# EAGLE design 313_lora_CMWX1ZZABZ (EAGLE 9.6.2)
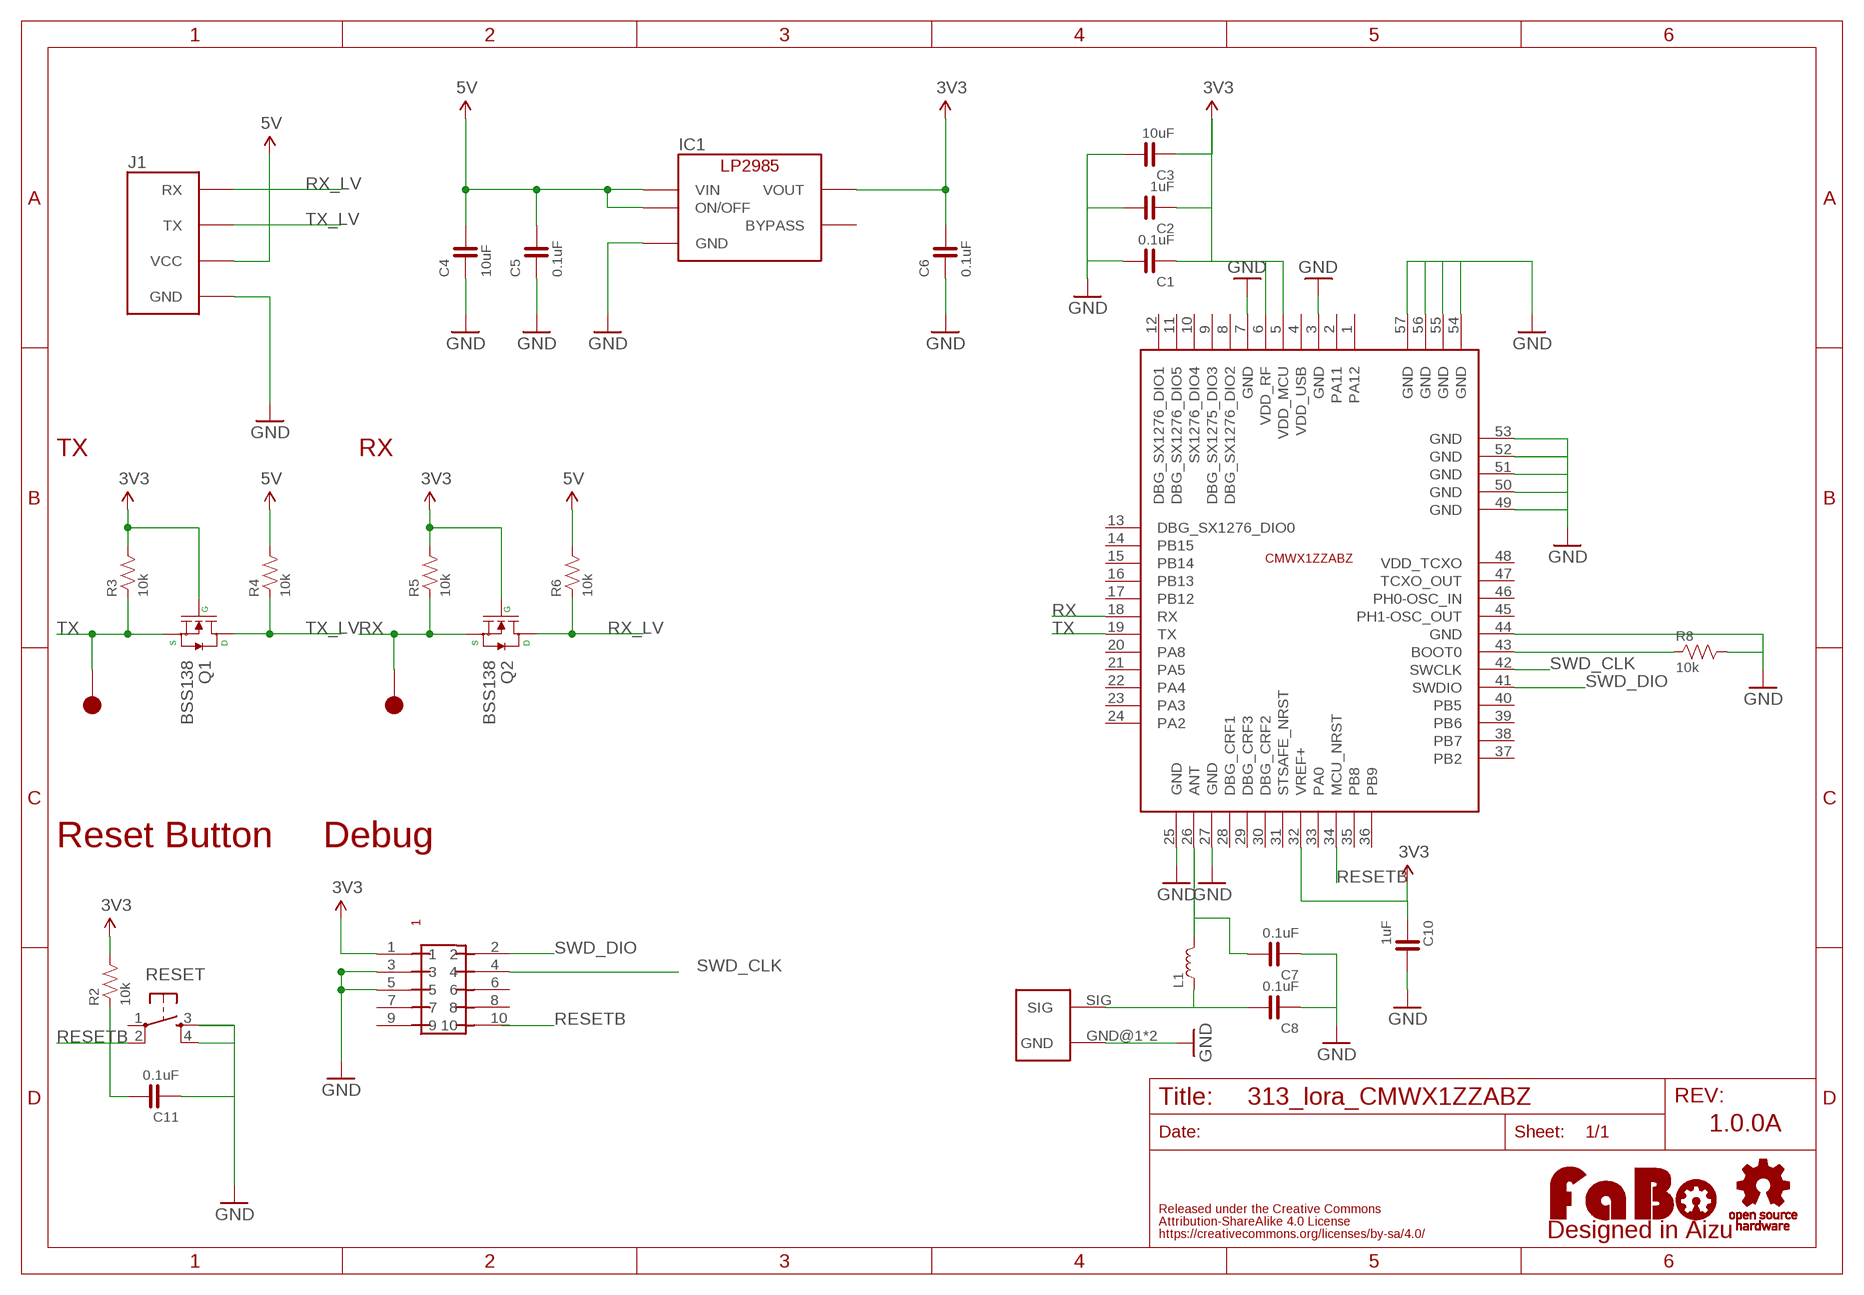
[diagram p0: schematic, sheet 1]

## Parts
C1  0.1uF  CAPACITOR-0603_NARROW  [0603-NARROW]
C2  1uF  CAPACITOR-0603_NARROW  [0603-NARROW]
C3  10uF  CAPACITOR-0603_NARROW  [0603-NARROW]
C4  10uF  CAPACITOR-0603_NARROW  [0603-NARROW]
C5  0.1uF  CAPACITOR-0603_NARROW  [0603-NARROW]
C6  0.1uF  CAPACITOR-0603_NARROW  [0603-NARROW]
C7  0.1uF  CAPACITOR-0603_NARROW  [0603-NARROW]
C8  0.1uF  CAPACITOR-0603_NARROW  [0603-NARROW]
C10  1uF  CAPACITOR-0603_NARROW  [0603-NARROW]
C11  0.1uF  CAPACITOR-0603_NARROW  [0603-NARROW]
IC1  LP2985-33DBV  [SOT-23-5]
J1  FABO_BRICK_SERIAL-LONGER  [FABO_BRICK_SERIAL_LONGER]
L1  COIL-0603  [0603]
LOGO1  LOGO_FABO-M_BOTTOM  [LOGO_FABO_M_BOTTOM]
Q1  BSS138  MOSFET-N  [SOT23-3]
Q2  BSS138  MOSFET-N  [SOT23-3]
R2  10k  RESISTOR-0603-NARROW  [0603-NARROW]
R3  10k  RESISTOR-0603-NARROW  [0603-NARROW]
R4  10k  RESISTOR-0603-NARROW  [0603-NARROW]
R5  10k  RESISTOR-0603-NARROW  [0603-NARROW]
R6  10k  RESISTOR-0603-NARROW  [0603-NARROW]
R8  10k  RESISTOR-0603-NARROW  [0603-NARROW]
RESET  TACT-SWITCH-SMD_KMR2  [KMR2]
TP10  TP-15  [TP-15]
TP11  TP-15  [TP-15]
U$2  LOGO_OSHW-M_BOTTOM  [LOGO_OSHW_M_BOTTOM]
U$3  CMWX1ZZABZ  [CMWX1ZZABZ]
U$8  PIN-HEADER-SMT(1.27MM)2X5  [PIN-HEADER-SMT(1.27MM)2X5]
UF1  HIROSE-U.FL  [HIROSE-UF.L]

## Nets
3V3: C1.1 C2.1 C3.1 C6.2 C10.1 IC1.5(VOUT) Q1.1(G) Q2.1(G) R2.2 R3.2 R5.2 U$3.5(VDD_MCU) U$3.6(VDD_RF) U$3.32(VREF+) U$8.1
5V: C4.2 C5.2 IC1.1(VIN) IC1.3(ON/OFF) J1.VCC R4.2 R6.2
GND: C1.2 C2.2 C3.2 C4.1 C5.1 C6.1 C7.1 C8.1 C10.2 C11.1 IC1.2(GND) J1.GND R8.2 RESET.3 RESET.4 U$3.3(GND) U$3.7(GND) U$3.25(GND) U$3.27(GND) U$3.44(GND) U$3.49(GND) U$3.50(GND) U$3.51(GND) U$3.52(GND) U$3.53(GND) U$3.54(GND) U$3.55(GND) U$3.56(GND) U$3.57(GND) U$8.3 U$8.5 UF1.GND@1(GND) UF1.GND@2(GND)
N$2: C7.2 L1.2 U$3.26(ANT)
N$3: C8.2 L1.1 UF1.SIG
N$4: R8.1 U$3.43(BOOT0)
RESETB: C11.2 R2.1 RESET.2 U$3.34(MCU_NRST) U$8.10
RX: Q2.2(S) R5.1 TP10.1 U$3.18(RX)
RX_LV: J1.RX Q2.3(D) R6.1
SWD_CLK: U$3.42(SWCLK) U$8.4
SWD_DIO: U$3.41(SWDIO) U$8.2
TX: Q1.2(S) R3.1 TP11.1 U$3.19(TX)
TX_LV: J1.TX Q1.3(D) R4.1
Unconnected: IC1.4(BYPASS) RESET.1 U$3.1(PA12) U$3.2(PA11) U$3.4(VDD_USB) U$3.8(DBG_SX1276_DIO2) U$3.9(DBG_SX1275_DIO3) U$3.10(SX1276_DIO4) U$3.11(DBG_SX1276_DIO5) U$3.12(DBG_SX1276_DIO1) U$3.13(DBG_SX1276_DIO0) U$3.14(PB15) U$3.15(PB14) U$3.16(PB13) U$3.17(PB12) U$3.20(PA8) U$3.21(PA5) U$3.22(PA4) U$3.23(PA3) U$3.24(PA2) U$3.28(DBG_CRF1) U$3.29(DBG_CRF3) U$3.30(DBG_CRF2) U$3.31(STSAFE_NRST) U$3.33(PA0) U$3.35(PB8) U$3.36(PB9) U$3.37(PB2) U$3.38(PB7) U$3.39(PB6) U$3.40(PB5) U$3.45(PH1-OSC_OUT) U$3.46(PH0-OSC_IN) U$3.47(TCXO_OUT) U$3.48(VDD_TCXO) U$8.6 U$8.7 U$8.8 U$8.9

## Notes on the sheet
- TX | RX
- Reset Button | Debug
- 1.0.0A

## Library data of the parts
C1-C8 C10 C11 = FaBo-Capacitor:CAPACITOR: CAPACITOR
IC1 = FaBo-Supply:LP2985: LP2985
J1 = FaBo-Template:FABO_BRICK_SERIAL: FaBo Brick Serial
L1 = FaBo-Coil:COIL: RESISTOR
LOGO1 = component:LOGO_FABO
Q1 Q2 = FaBo-etc:MOSFET-N
R2-R6 R8 = FaBo-Resistors:RESISTOR: RESISTOR
RESET = FaBo-Switch:TACT-SWITCH
TP10 TP11 = FaBo-Supply:TP
U$2 = component:LOGO_OSHW
U$3 = FaBo-LoRa:CMWX1ZZABZ
U$8 = GClue:PIN-HEADER-SMT(1.27MM)2X5: PIN-HEADER-SMT (1.27MM) 2x5
UF1 = FaBo-Connetor:HIROSE-U.FL

## Board
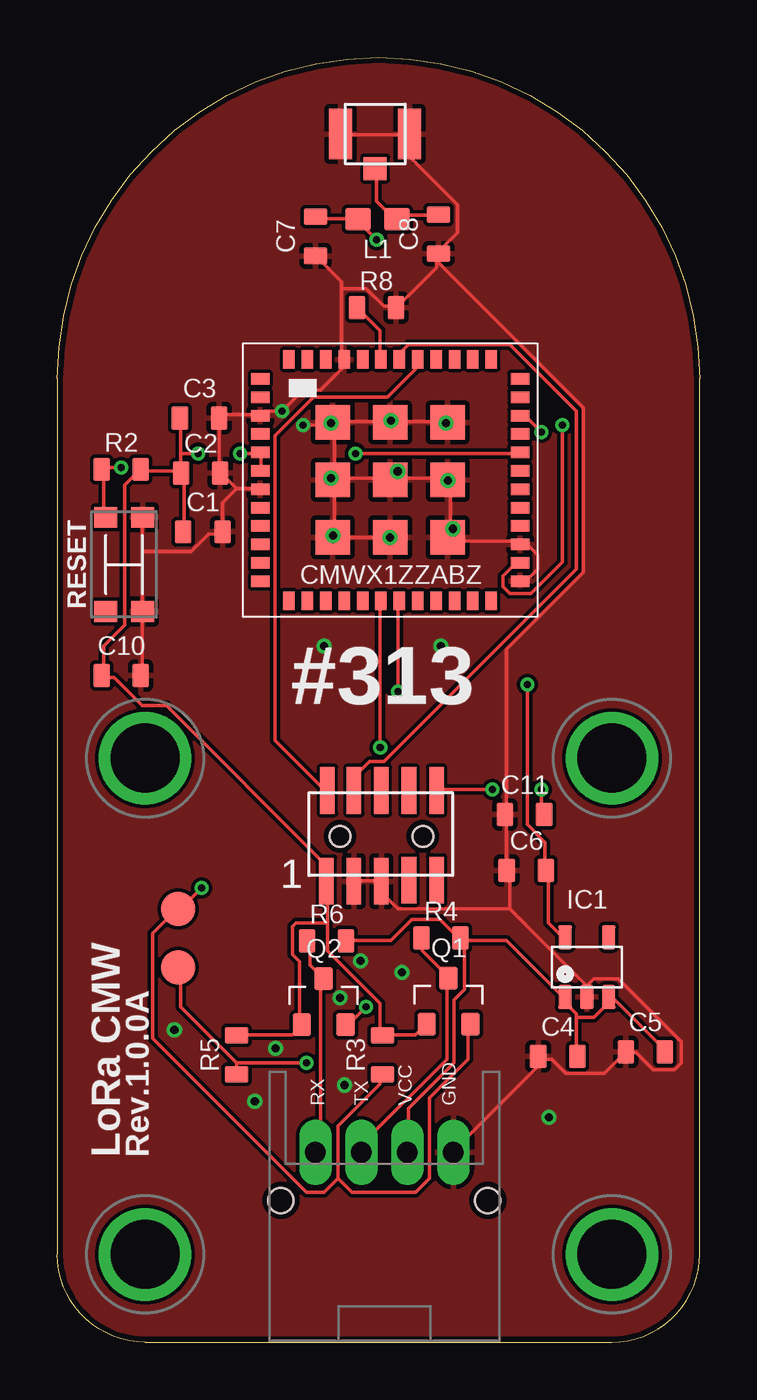
[diagram p1: board, top side]
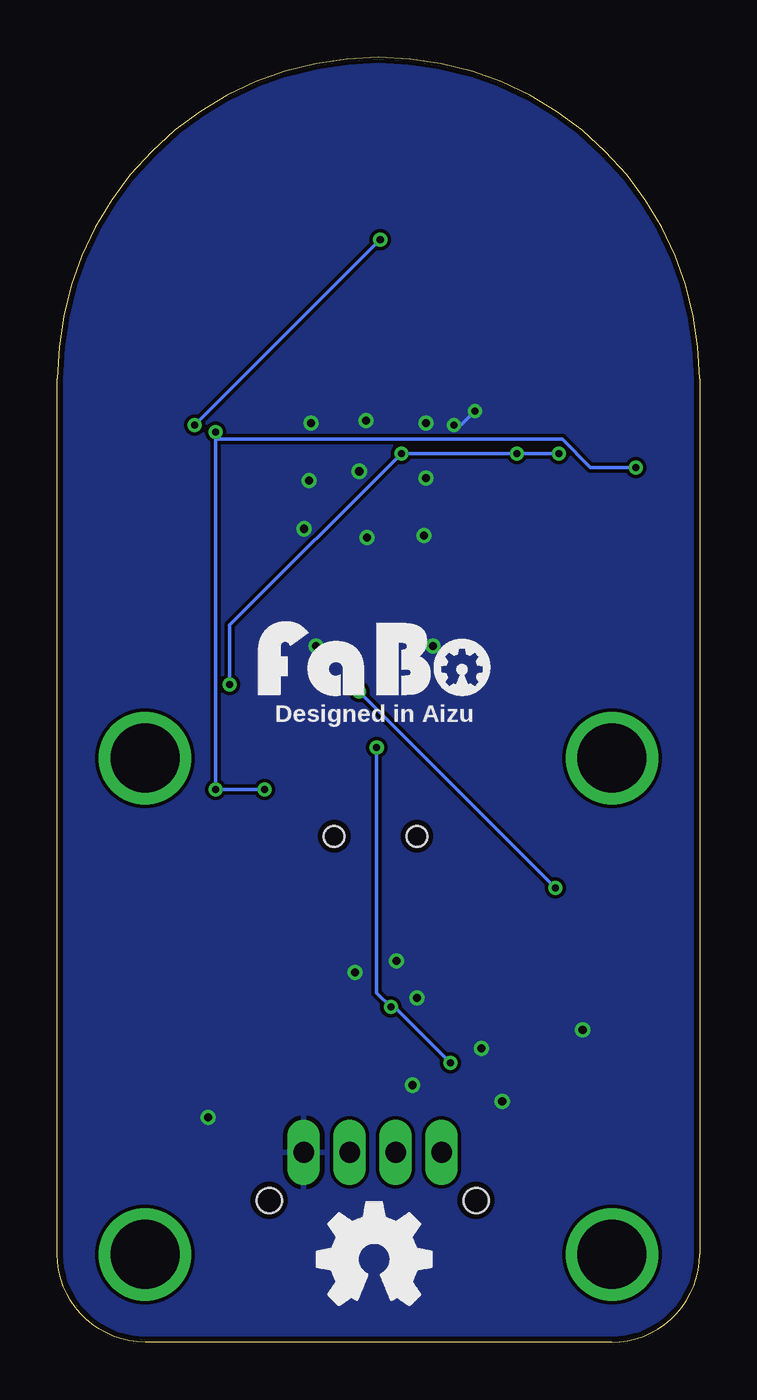
[diagram p2: board, bottom side, seen from below]

Size 27.94 x 55.88 mm. Coordinates in mm from the lower left corner, seen from the top.
Copper layers (1*16): Top 0.035mm / dielectric 1.6mm / Bottom 0.035mm
Design rules "PCBway": minimum track width 6mil, minimum drill 12mil, track to track 6mil, track to pad 6mil, pad to pad 6mil, via to via 6mil, smd to smd 6mil, copper to edge 10mil, drill to drill 10mil, minimum pad ring 10mil, minimum via ring 6mil, stop-mask expansion 2mil, vias tented up to drill 100mil, thermal gap 8mil

### Footprints (pad centres in the part's own frame; a part is rotated, then mirrored left to right if it is on the bottom)
0603-NARROW = smd 0.71 x 1: 1 -0.85,0; 2 0.85,0
SOT-23-5 = smd 0.6 x 1.05: 1 -0.95,-1.3; 2 0,-1.3; 3 0.95,-1.3; 4 0.95,1.3; 5 -0.95,1.3
FABO_BRICK_SERIAL_LONGER = drill 0.9 pad 1.422 long: GND 3.254,-17.145; RX -2.746,-17.145; TX -0.746,-17.145; VCC 1.254,-17.145 | drill 3 pad 3.81: P$5 -10.16,0; P$6 10.16,0; P$7 -10.16,-21.59; P$8 10.16,-21.59 | hole 1.1: -4.246,-19.245; 4.754,-19.245
0603 = smd 1.1 x 1: 1 -0.85,0; 2 0.85,0
SOT23-3 = smd 0.8 x 1: 1 -0.95,-1; 2 0.95,-1; 3 0,1
KMR2 = smd 0.9 x 1: 1 -2.05,0.8; 2 2.05,0.8; 3 2.05,-0.8; 4 -2.05,-0.8
TP-15 = smd 1.5 x 1.5: 1 0,0
CMWX1ZZABZ = smd 0.8 x 0.5: 1 -5.65,4.4; 2 -5.65,3.6; 3 -5.65,2.8; 4 -5.65,2; 5 -5.65,1.2; 6 -5.65,0.4; 7 -5.65,-0.4; 8 -5.65,-1.2; 9 -5.65,-2; 10 -5.65,-2.8; 11 -5.65,-3.6; 12 -5.65,-4.4; 25 5.65,-4.4; 26 5.65,-3.6; 27 5.65,-2.8; 28 5.65,-2; 29 5.65,-1.2; 30 5.65,-0.4; 31 5.65,0.4; 32 5.65,1.2; 33 5.65,2; 34 5.65,2.8; 35 5.65,3.6; 36 5.65,4.4 | smd 0.5 x 0.8: 13 -4.4,-5.25; 14 -3.6,-5.25; 15 -2.8,-5.25; 16 -2,-5.25; 17 -1.2,-5.25; 18 -0.4,-5.25; 19 0.4,-5.25; 20 1.2,-5.25; 21 2,-5.25; 22 2.8,-5.25; 23 3.6,-5.25; 24 4.4,-5.25; 37 4.4,5.25; 38 3.6,5.25; 39 2.8,5.25; 40 2,5.25; 41 1.2,5.25; 42 0.4,5.25; 43 -0.4,5.25; 44 -2,5.25; 45 -1.2,5.25; 46 -2.8,5.25; 47 -3.6,5.25; 48 -4.4,5.25 | smd 1.5 x 1.5: 49 -2.5,2.5; 50 0,2.5; 51 2.5,2.5; 52 -2.5,0; 53 0,0; 54 2.5,0; 55 -2.5,-2.5; 56 0,-2.5; 57 2.5,-2.5
PIN-HEADER-SMT(1.27MM)2X5 = smd 0.635 x 2.032: 1 -2.4,-1.95; 2 -2.35,2; 3 -1.2,-1.95; 4 -1.2,2; 5 0,-1.95; 6 0,2; 7 1.2,-1.9; 8 1.2,2; 9 2.4,-1.9; 10 2.4,2 | hole 0.9: 1.8,0; -1.8,0
HIROSE-UF.L = smd 1 x 2.2: GND@1 -1.5,0; GND@2 1.5,0 | smd 1 x 1: SIG 0,-1.5

### Placement (x,y rotation side)
C1  6.33,35.25 0 top
C2  6.23,37.8 0 top
C3  6.18,40.2 0 top
C4  21.77,12.43 0 top
C5  25.58,12.63 0 top
C6  20.4,20.52 0 top
C7  11.23,48.1 90 top
C8  16.58,48.2 90 top
C10  2.78,29 0 top
C11  20.33,22.95 0 top
IC1  23.04,16.31 0 top
J1  13.97,25.4 0 top
L1  13.93,48.85 180 top
LOGO1  14.15,27.74 0 top
Q1  17.02,14.83 0 top
Q2  11.58,14.81 0 top
R2  2.77,37.96 0 top
R3  14.15,12.5 90 top
R4  16.69,17.58 0 top
R5  7.8,12.5 90 top
R6  11.71,17.45 0 top
R8  13.88,45 0 top
RESET  2.9,33.83 90 top
TP10  5.26,16.31 0 top
TP11  5.26,18.85 0 top
U$2  14.15,3.61 0 top
U$3  14.48,37.5 0 top
U$8  14.1,22 0 top
UF1  13.83,52.55 0 top

### Tracks (layer width: path | path; a pad name or v marks a point on that pad's centre or on a via)
3V3  (via drill 0.3)
  Top 0.152: IC1.5 21.97,17.63 21.36,18.24 21.36,20.37 C6.2 21.21,20.52 21.21,21.74 20.45,22.5 v20.45,28.6 | U$3.6 8.86,37.9 8.86,38.66 U$3.5 8.71,38.66 v7.95,38.66 | v12.98,38.66 19.99,38.66 U$3.32 | 5.36,37.9 3.68,37.9 R2.2 3.53,37.9 2.92,37.29 2.92,31.19 2.01,30.28 2.01,29.06 C10.1 2.01,28.9 2.46,28.9 3.68,27.69 4.75,27.69 11.61,20.83 11.61,20.07 U$8.1 11.76,19.91 11.76,18.24 | 5.36,37.9 5.36,38.66 | 5.36,38.66 5.36,40.18 C3.1 | 5.36,37.9 C2.1 5.51,37.74 5.51,35.31 C1.1 | R5.2 7.8,13.36 10.24,13.36 10.54,13.66 Q2.1 10.54,13.82 10.54,16.56 10.24,16.87 10.24,18.08 10.39,18.24 11.76,18.24 | Q1.1 16.03,13.82 15.57,13.36 14.2,13.36 R3.2 14.05,13.36 14.05,14.73 11.76,17.02 11.76,18.24 | 5.36,38.66 v6.12,38.66
  Bottom 0.152: v20.45,28.6 20.45,31.19 v12.98,38.66 v7.95,38.66 v6.12,38.66
5V
  Top 0.152: R6.2 12.67,17.47 14.5,17.47 15.42,18.39 16.64,18.39 17.4,17.63 R4.2 | 22.58,14.12 22.58,14.27 21.97,14.88 IC1.1 21.97,15.04 19.53,17.47 17.7,17.47 | 22.58,14.12 22.58,12.45 C4.2 | C5.2 26.39,12.75 24.1,15.04 IC1.3 24.1,14.88 23.34,14.12 22.58,14.12 | 17.7,17.47 17.55,17.47 R4.2 | 17.7,17.47 17.7,15.34 17.25,14.88 17.25,12.14 15.27,10.16 15.27,8.33 J1.VCC | 17.7,17.47 R4.2
GND  (via drill 0.3, 0.35)
  Top 0.152: J1.GND 17.25,8.33 20.9,11.99 20.9,12.29 C4.1 21.06,12.29 21.51,12.29 22.12,11.68 23.8,11.68 24.71,12.6 C5.1 24.87,12.6 25.17,12.6 25.93,11.84 26.85,11.84 27.15,12.14 27.15,13.06 24.41,15.8 23.34,15.8 23.04,15.49 | U$8.3 12.98,20.07 14.05,20.07 U$8.5 14.2,19.91 14.2,19.46 14.81,18.85 19.68,18.85 | 23.04,15.49 IC1.2 23.04,15.04 | 19.68,18.85 23.04,15.49 | 19.68,18.85 19.68,20.37 C6.1 19.53,20.52 19.53,22.81 C11.1 19.53,22.96 19.53,30.12 22.89,33.48 22.89,40.64 16.48,47.04 | UF1.GND@1 12.37,52.53 15.27,52.53 UF1.GND@2 15.42,52.53 15.42,51.46 17.4,49.48 17.4,48.26 16.64,47.5 C8.1 | 12.37,45.82 12.37,46.13 11.3,47.19 C7.1 | 12.37,45.82 12.37,42.77 U$3.44 12.37,42.62 12.37,42.32 11.46,41.4 10.69,41.4 v9.78,40.49 9.02,40.49 8.86,40.33 U$3.3 8.71,40.33 7.04,40.33 C3.2 7.04,40.18 7.04,37.9 C2.2 7.19,37.74 7.8,37.13 | 12.37,45.82 13.44,45.82 14.2,45.06 14.66,45.06 R8.2 14.81,45.06 16.48,46.74 16.48,47.04 | 16.48,47.04 16.48,47.35 C8.1 | U$3.25 20.14,33.17 20.45,33.17 20.9,33.63 20.9,34.24 20.45,34.7 20.14,34.7 U$3.27 19.99,34.85 17.09,34.85 U$3.57 17.09,35 17.09,37.44 U$3.54 16.94,37.59 14.5,37.59 U$3.53 14.35,37.59 12.06,37.59 | 12.06,35 14.35,35 U$3.56 | 12.06,37.59 12.06,39.88 U$3.49 | 12.06,37.59 U$3.52 12.06,37.44 12.06,35 | U$3.49 12.06,40.03 14.35,40.03 U$3.50 14.5,40.03 16.94,40.03 U$3.51 | 12.06,35 U$3.55 | 7.8,37.13 8.71,37.13 U$3.7 | 7.8,37.13 7.19,36.52 7.19,35.31 C1.2 7.04,35.15 6.58,35.15 5.82,34.39 3.68,34.39 | C10.2 3.68,29.06 3.68,31.65 RESET.4 3.68,31.8 3.68,34.39 | 3.68,34.39 3.68,35.76 RESET.3 | v10.69,39.88 11.91,39.88 U$3.49
  Top 0.152: 16.48,47.04 C8.1
  Bottom 0.152: v10.69,39.88 10.39,39.88 v9.78,40.49
  other vias: 11.61,30.28 16.69,30.28 14.48,35 16.99,37.48 14.99,16.08 5.09,13.58 12.49,11.18 8.59,10.48 9.49,12.78 13.19,16.58 12.29,14.98 21.39,9.78 11.99,35.08 11.91,39.98 14.51,40.08 16.91,39.98 11.91,37.58 17.21,35.38 14.81,37.88
  pour Bottom: 0.18,-0.2 0.18,56.31 28.12,56.31 28.12,-0.2
  pour Top: 0.18,-0.2 0.18,56.31 28.12,56.31 28.12,-0.2
N$2  (via drill 0.3)
  Top 0.152: v21.97,39.88 21.97,33.93 20.6,32.56 19.68,32.56 19.38,32.87 19.38,33.32 19.84,33.78 19.99,33.78 U$3.26 | v13.89,47.95 13.13,48.72 L1.2 12.98,48.87 11.3,48.87 C7.2
  Bottom 0.152: v13.89,47.95 v21.97,39.88
N$3
  Top 0.152: C8.2 16.48,49.02 14.96,49.02 14.81,48.87 L1.1 14.66,48.87 13.89,49.63 13.89,51 UF1.SIG
N$4
  Top 0.152: U$3.43 14.05,42.77 14.05,43.99 13.13,44.91 R8.1
RESETB  (via drill 0.3)
  Top 0.152: RESET.2 2.01,35.92 2.01,37.9 R2.1 2.01,38.05 v2.77,38.05 | v21.06,39.57 20.45,40.18 20.14,40.18 U$3.34 | v21.06,24.03 21.06,22.96 C11.2 | v18.92,24.03 16.64,24.03 U$8.10
  Bottom 0.152: 21.06,39.27 v21.06,24.03 v18.92,24.03 | 21.06,39.27 v21.06,39.57 | v2.77,38.05 4.75,38.05 5.97,39.27 21.06,39.27
RX  (via drill 0.3)
  Top 0.152: 7.8,12.14 R5.1 | 7.8,12.14 5.36,14.58 5.36,16.26 TP10.1 | v14.05,25.86 14.05,32.11 U$3.18 | v13.44,14.58 12.67,13.82 Q2.2 | v10.85,12.14 7.8,12.14
  Bottom 0.152: v14.05,25.86 14.05,15.19 v13.44,14.58 13.28,14.58 v10.85,12.14
RX_LV
  Top 0.152: R6.1 11,17.32 11,16.41 11.46,15.95 Q2.3 11.46,15.8 11.46,8.48 11.3,8.33 J1.RX
SWD_CLK
  Top 0.152: U$3.42 14.96,42.77 14.96,43.08 15.27,43.38 19.68,43.38 22.58,40.49 22.58,33.63 14.2,25.25 13.59,25.25 12.98,24.64 12.98,24.03 U$8.4
SWD_DIO
  Top 0.152: U$3.41 15.57,42.62 15.57,42.32 14.35,41.1 11.15,41.1 9.47,39.42 9.47,26.16 11.61,24.03 U$8.2
TX  (via drill 0.3)
  Top 0.152: 12.22,7.11 12.22,9.4 14.05,11.23 14.05,11.53 R3.1 | 12.22,7.11 12.83,6.5 15.57,6.5 16.18,7.11 16.18,10.62 17.86,12.29 17.86,13.82 Q1.2 | v14.81,28.3 14.81,32.11 U$3.19 | v6.27,19.76 5.36,18.85 TP11.1 5.21,18.85 4.14,17.78 4.14,13.21 10.85,6.5 11.61,6.5 12.22,7.11
  Bottom 0.152: v6.27,19.76 v14.81,28.3
TX_LV
  Top 0.152: R4.1 15.87,17.47 15.87,17.02 16.94,15.95 Q1.3 16.94,15.8 16.94,12.29 13.28,8.64 13.28,8.33 J1.TX

### Text on the board
tPlace: #313 | LoRa CMW | Rev.1.0.0A
bPlace: Designed in Aizu